# EAGLE design card (EAGLE 7.3.0)
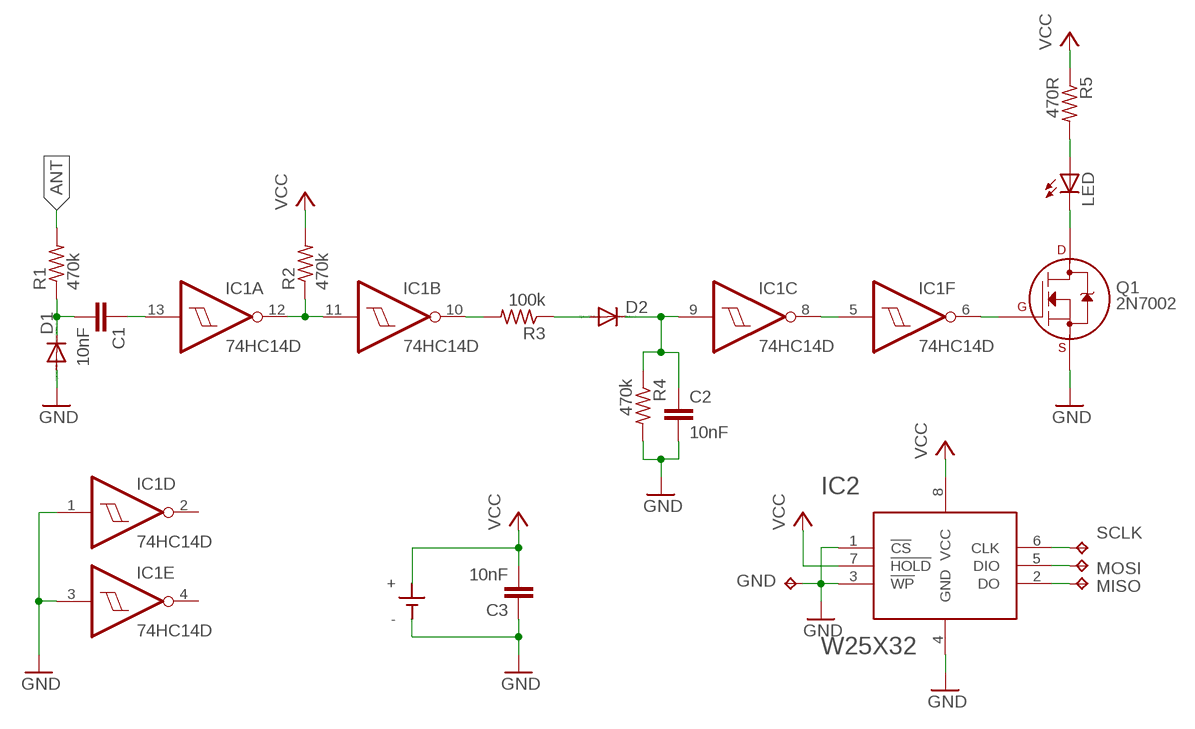
[diagram p0: schematic, sheet 1]

## Parts
BAT  KB3003  [KB3003]
C1  10nF  C-EUC1206K  [C1206K]
C2  10nF  C-EUC1206K  [C1206K]
C3  10nF  C-EUC1206K  [C1206K]
D1  DIODE-MINIMELF  [MINIMELF]
D2  DIODE-MINIMELF  [MINIMELF]
GND  TPB1,27  [B1,27]
IC1  74HC14D  [SO14]
IC2  W25X32  [SOIC8]
LED  LEDCHIPLED_1206  [CHIPLED_1206]
MISO  TPB1,27  [B1,27]
MOSI  TPB1,27  [B1,27]
Q1  2N7002  2N7000_SOT23  [SOT-23]
R1  470k  R-US_M1206  [M1206]
R2  470k  R-US_M1206  [M1206]
R3  100k  R-US_M1206  [M1206]
R4  470k  R-US_M1206  [M1206]
R5  470R  R-US_M1206  [M1206]
SCLK  TPB1,27  [B1,27]

## Nets
ANT: R1.2
GND: BAT.- C2.2 C3.1 D1.A GND.TP IC1.1(D:I) IC1.3(E:I) IC2.1(!CS!) IC2.3(!WP!) IC2.4(GND) Q1.2(S) R4.2
N$1: C1.1 IC1.13(A:I)
N$2: C1.2 D1.C R1.1
N$3: LED.A R5.2
N$4: LED.C Q1.3(D)
N$5: IC1.11(B:I) IC1.12(A:O) R2.1
N$6: IC1.10(B:O) R3.2
N$7: D2.A R3.1
N$8: C2.1 D2.C IC1.9(C:I) R4.1
N$9: IC2.5(DIO) MOSI.TP
N$10: IC2.6(CLK) SCLK.TP
N$11: IC1.5(F:I) IC1.8(C:O)
N$12: IC1.6(F:O) Q1.1(G)
N$88: IC2.2(DO) MISO.TP
VCC: BAT.+@1(+) BAT.+@2(+) C3.2 IC2.7(!HOLD!) IC2.8(VCC) R2.2 R5.1
Unconnected: IC1.2(D:O) IC1.4(E:O)

## Power pins joined to a net without a drawn wire
GND: IC1.7(P:GND)
VCC: IC1.14(P:VCC)

## Library data of the parts
BAT = bat:KB3003
C1-C3 = resistor:C-EU: CAPACITOR, European symbol
D1 D2 = diode:DIODE-: DIODE
GND MISO MOSI SCLK = testpad:TP: Test pad
IC1 = 74xx-eu:74*14: Hex schmitt trigger INVERTER
IC2 = bat:W25X32: Winbond W25X32 SPI Flash
LED = led:LED: LED OSRAM: - CHIPLED LG R971, LG N971, LY N971, LG Q971, LY Q971, LO R971, LY R971 LH N974, LH R974 LS Q976, LO Q976, LY Q976 LO Q996 - Hyper CHIPLED LW Q18S LB Q993, LB Q99A, LB R99A - SideLED LS A670, LO A670, LY A670, LG A670, LP A670 LB A673, LV A673, LT A673, LW A673 LH A674 LY A675 LS A676, LA A676, LO A676, LY A676, LW A676 LS A679, LY A679, LG A679 - Hyper Micro SIDELED® LS Y876, LA Y876, LO Y876, LY Y876 LT Y87S - SmartLED LW L88C, LW L88S LB L89C, LB L89S, LG L890 LS L89K, LO L89K, LY L89K LS L896, LA L896, LO L896, LY L896 - TOPLED LS T670, LO T670, LY T670, LG T670, LP T670 LSG T670, LSP T670, LSY T670, LOP T670, LYG T670 LG T671, LOG T671, LSG T671 LB T673, LV T673, LT T673, LW T673 LH T674 LS T676, LA T676, LO T676, LY T676, LB T676, LH T676, LSB T676, LW T676 LB T67C, LV T67C, LT T67C, LS T67K, LO T67K, LY T67K, LW E67C LS E67B, LA E67B, LO E67B, LY E67B, LB E67C, LV E67C, LT E67C LW T67C LS T679, LY T679, LG T679 LS T770, LO T770, LY T770, LG T770, LP T770 LB T773, LV T773, LT T773, LW T773 LH T774 LS E675, LA E675, LY E675, LS T675 LS T776, LA T776, LO T776, LY T776, LB T776 LHGB T686 LT T68C, LB T68C - Hyper Mini TOPLED® LB M676 - Mini TOPLED Santana® LG M470 LS M47K, LO M47K, LY M47K Source: http://www.osram.convergy.de LUXEON: - LUMILED® LXK2-PW12-R00, LXK2-PW12-S00, LXK2-PW14-U00, LXK2-PW14-V00 LXK2-PM12-R00, LXK2-PM12-S00, LXK2-PM14-U00 LXK2-PE12-Q00, LXK2-PE12-R00, LXK2-PE12-S00, LXK2-PE14-T00, LXK2-PE14-U00 LXK2-PB12-K00, LXK2-PB12-L00, LXK2-PB12-M00, LXK2-PB14-N00, LXK2-PB14-P00, LXK2-PB14-Q00 LXK2-PR12-L00, LXK2-PR12-M00, LXK2-PR14-Q00, LXK2-PR14-R00 LXK2-PD12-Q00, LXK2-PD12-R00, LXK2-PD12-S00 LXK2-PH12-R00, LXK2-PH12-S00 LXK2-PL12-P00, LXK2-PL12-Q00, LXK2-PL12-R00 Source: www.luxeon.com KINGBRIGHT: KA-3528ASYC Source: www.kingbright.com
Q1 = transistors:2N700*: 2N7000, 2N7002, NDS7002A N-channel enhancement mode MOSFET
R1-R5 = resistor:R-US_: RESISTOR, American symbol

## Board
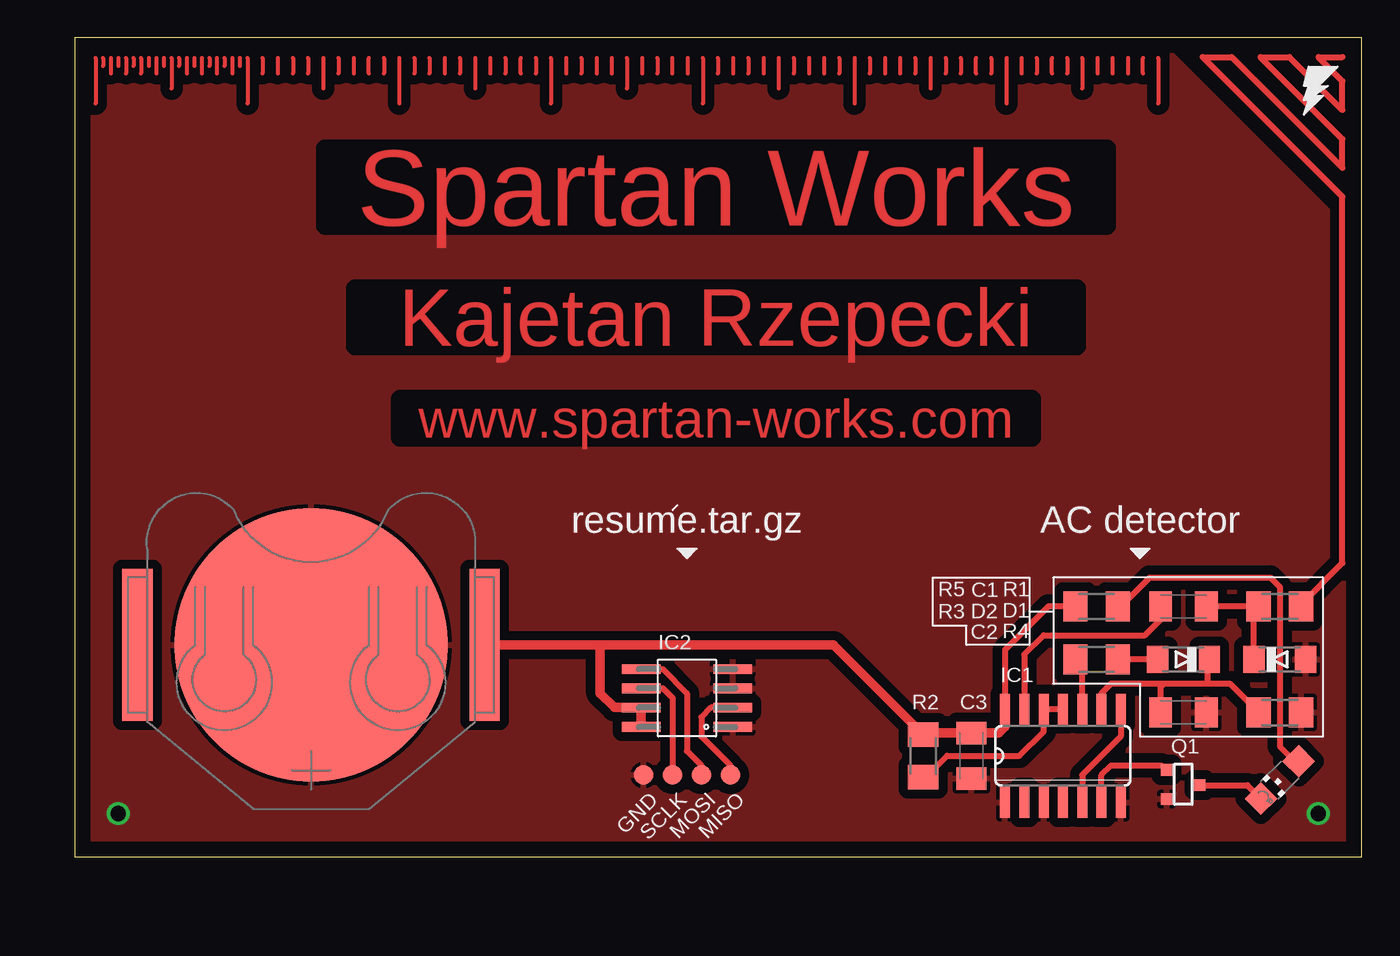
[diagram p1: board, top side]
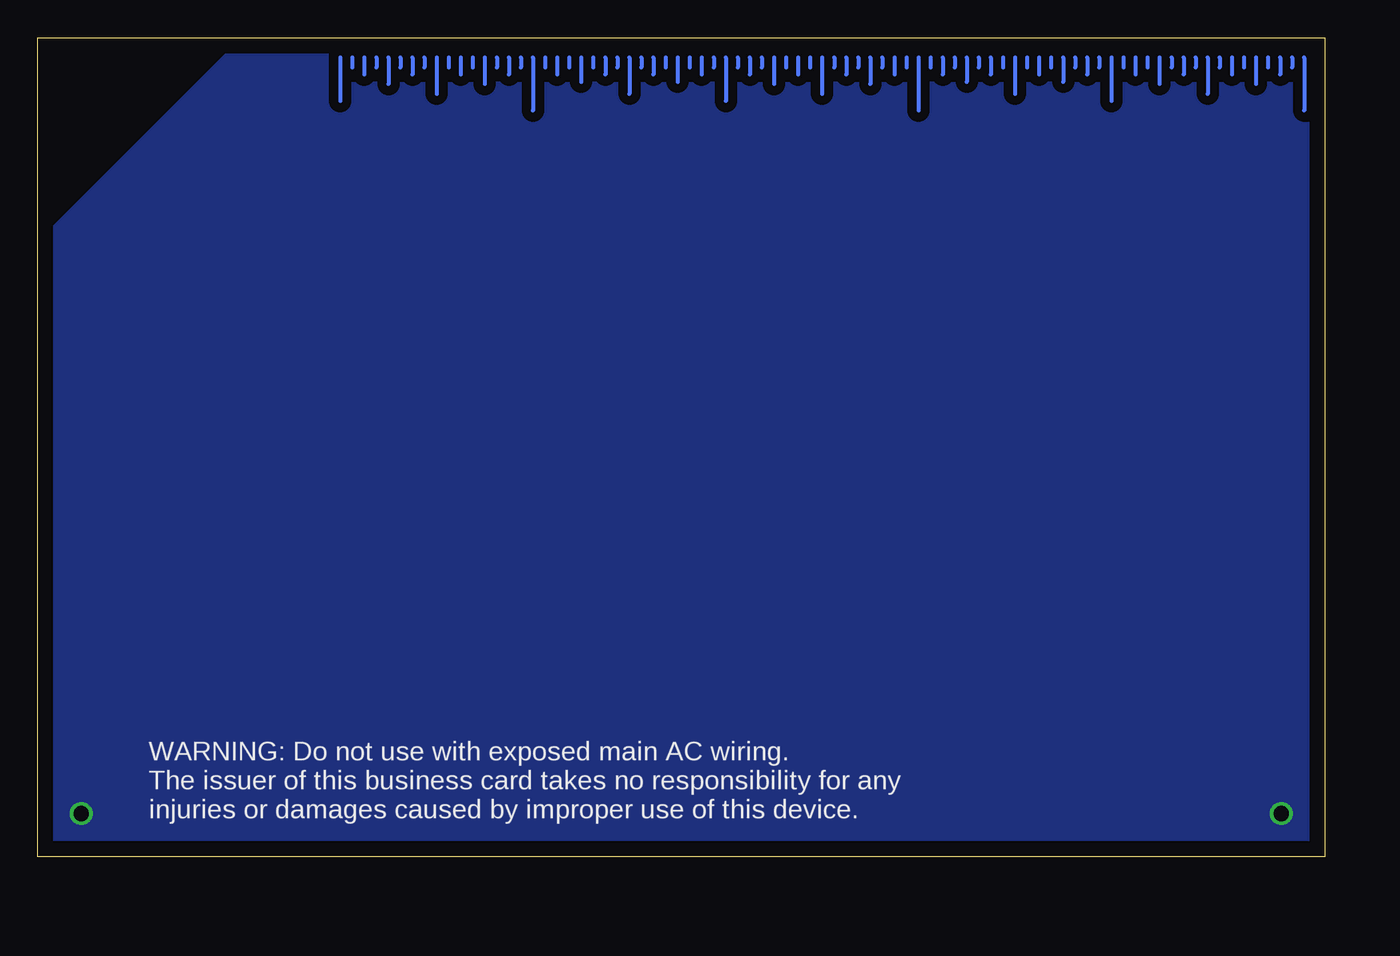
[diagram p2: board, bottom side, seen from below]

Size 84.76 x 53.97 mm. Coordinates in mm from the lower left corner, seen from the top.
Outline: 0,0 84.76,0 84.76,53.97 0,53.97 0,0
Copper layers (1*16): Top 0.035mm / dielectric 1.5mm / Bottom 0.035mm
Design rules "default": minimum track width 10mil, minimum drill 24mil, track to track 8mil, track to pad 8mil, pad to pad 8mil, via to via 8mil, smd to smd 8mil, copper to edge 40mil, drill to drill 8mil, minimum pad ring 10mil, minimum via ring 8mil, stop-mask expansion 4mil, vias tented up to drill 0mil, thermal gap 10mil

### Footprints (pad centres in the part's own frame; a part is rotated, then mirrored left to right if it is on the bottom)
KB3003 = smd 2 x 10: +@1 -11.43,0; +@2 11.43,0 | smd 18 x 18: - 0,0
C1206K = smd 1.5 x 2: 1 -1.5,0; 2 1.5,0
MINIMELF = smd 1.4 x 1.8: A 1.7,0; C -1.7,0
B1,27 = smd 1.27 x 1.27: TP 0,0
SO14 = smd 0.66 x 2.032: 1 -3.81,-3.073; 2 -2.54,-3.073; 3 -1.27,-3.073; 4 0,-3.073; 5 1.27,-3.073; 6 2.54,-3.073; 7 3.81,-3.073; 8 3.81,3.073; 9 2.54,3.073; 10 1.27,3.073; 11 0,3.073; 12 -1.27,3.073; 13 -2.54,3.073; 14 -3.81,3.073
SOIC8 = smd 2.54 x 0.635: 1 -3.016,2.54; 2 -3.016,1.27; 3 -3.016,0; 4 -3.016,-1.27; 5 3.016,-1.27; 6 3.016,0; 7 3.016,1.27; 8 3.016,2.54
CHIPLED_1206 = smd 1.5 x 1.5: A 0,-1.75; C 0,1.75
SOT-23 = smd 0.762 x 0.762: 1 -0.979,-1.101; 2 0.94,-1.101; 3 0.025,1.067
M1206 = smd 1.6 x 2: 1 -1.4,0; 2 1.4,0

### Placement (x,y rotation side)
BAT  15.56,13.97 0 top
C1  73.03,16.51 0 top
C2  73.03,9.53 0 top
C3  59.05,6.67 90 top
D1  79.38,13.02 0 top
D2  73.03,13.02 180 top
GND  37.47,5.4 180 top
IC1  65.09,6.67 0 top
IC2  40.32,11.11 180 top
LED  79.38,5.08 135 top
MISO  43.18,5.4 180 top
MOSI  41.27,5.4 180 top
Q1  73.03,4.76 270 top
R1  79.38,16.51 0 top
R2  55.88,6.67 90 top
R3  67.31,13.02 180 top
R4  79.38,9.53 0 top
R5  67.31,16.51 0 top
SCLK  39.37,5.4 180 top

### Tracks (layer width: path | path; a pad name or v marks a point on that pad's centre or on a via)
ANT
  Top 0.406: 83.5,52.7 81.92,52.7 83.5,51.12 83.5,49.21 80.01,52.7 78.11,52.7 83.5,47.31 83.5,45.4 76.2,52.7 74.3,52.7 83.5,43.5 83.5,19.37 80.78,16.64 R1.2
GND  (via drill 1)
  other vias: 81.92,2.86 2.86,2.86
  pour Top (isolate 0.61): 0,53.98 0,0 84.77,0 84.77,40.32 71.12,53.98
  pour Bottom (isolate 0.61): 0,53.98 71.12,53.98 84.77,40.32 84.77,0 0,0
N$1
  Top 0.406: IC1.13 62.55,13.34 63.82,14.61 70.48,14.61 71.53,15.64 C1.1
N$2
  Top 0.406: D1.C 77.67,15.89 R1.1 C1.2
N$3
  Top 0.406: R5.2 68.71,16.32 70.8,18.41 78.74,18.41 79.38,17.78 79.38,7.3 80.61,6.07 LED.A
N$4
  Top 0.406: Q1.3 77.24,4.74 LED.C
N$5
  Top 0.406: IC1.11 IC1.12 63.82,8.26 62.23,6.67 57.47,6.67 56.07,5.27 R2.1
N$6
  Top 0.406: IC1.10 66.36,12.57 R3.2
N$7
  Top 0.406: D2.A R3.1
N$8
  Top 0.406: IC1.9 67.63,10.79 68.26,11.43 71.75,11.43 | D2.C 74.61,12.81 74.61,11.43 | 74.3,12.59 D2.C | 74.61,12.9 D2.C | 71.75,11.43 74.61,11.43 | 74.61,11.43 76.07,11.43 R4.1 | C2.1 71.53,11.2 71.75,11.43
N$9
  Top 0.406: IC2.5 38.73,12.38 40.32,10.79 40.32,6.99 41.27,6.03 MOSI.TP
N$10
  Top 0.406: IC2.6 38.73,11.11 39.37,10.48 SCLK.TP
N$11
  Top 0.406: IC1.8 68.9,7.94 66.36,5.4 IC1.5
N$12
  Top 0.406: IC1.6 67.63,5.4 68.26,6.03 71.58,6.03 Q1.1
N$13
  Top 0.254: 1.86,52.63 1.86,52.13
N$14
  Top 0.254: 2.87,52.63 2.87,52.13
N$15
  Top 0.254: 3.87,52.63 3.87,52.13
N$16
  Top 0.254: 4.87,52.63 4.87,52.13
N$17
  Top 0.254: 1.36,52.63 1.36,49.63
N$18
  Top 0.254: 2.37,52.63 2.37,51.63
N$19
  Top 0.254: 3.37,52.63 3.37,51.63
N$20
  Top 0.254: 4.37,52.63 4.37,51.63
N$21
  Top 0.254: 5.37,52.63 5.37,51.63
N$22
  Top 0.254: 6.37,52.63 6.37,50.63
N$23
  Top 0.254: 7.37,52.63 7.37,51.63
N$24
  Top 0.254: 8.37,52.63 8.37,51.63
N$25
  Top 0.254: 9.37,51.63 9.37,52.63
N$26
  Top 0.254: 10.37,52.63 10.37,51.63
N$27
  Top 0.254: 11.37,52.63 11.37,49.63
N$28
  Top 0.254: 12.37,52.63 12.37,51.63
N$29
  Top 0.254: 13.37,52.63 13.37,51.63
N$30
  Top 0.254: 14.37,52.63 14.37,51.63
N$31
  Top 0.254: 15.37,52.63 15.37,51.63
N$32
  Top 0.254: 16.36,52.63 16.36,50.63
N$33
  Top 0.254: 17.36,52.63 17.36,51.63
N$34
  Top 0.254: 18.36,52.63 18.36,51.63
N$35
  Top 0.254: 19.36,51.63 19.36,52.63
N$36
  Top 0.254: 20.36,52.63 20.36,51.63
N$37
  Top 0.254: 21.36,52.63 21.36,49.63
N$38
  Top 0.254: 22.36,52.63 22.36,51.63
N$39
  Top 0.254: 23.36,52.63 23.36,51.63
N$40
  Top 0.254: 24.36,52.63 24.36,51.63
N$41
  Top 0.254: 25.36,52.63 25.36,51.63
N$42
  Top 0.254: 26.36,52.63 26.36,50.63
N$43
  Top 0.254: 27.36,52.63 27.36,51.63
N$44
  Top 0.254: 28.36,52.63 28.36,51.63
N$45
  Top 0.254: 29.36,51.63 29.36,52.63
N$46
  Top 0.254: 30.36,52.63 30.36,51.63
N$47
  Top 0.254: 31.36,52.63 31.36,49.63
N$48
  Top 0.254: 32.37,52.63 32.37,51.63
N$49
  Top 0.254: 33.37,52.63 33.37,51.63
N$50
  Top 0.254: 34.37,52.63 34.37,51.63
N$51
  Top 0.254: 35.37,52.63 35.37,51.63
N$52
  Top 0.254: 36.37,52.63 36.37,50.63
N$53
  Top 0.254: 37.37,52.63 37.37,51.63
N$54
  Top 0.254: 38.37,52.63 38.37,51.63
N$55
  Top 0.254: 39.37,51.63 39.37,52.63
N$56
  Top 0.254: 40.37,52.63 40.37,51.63
N$57
  Top 0.254: 41.37,52.63 41.37,49.63
N$58
  Top 0.254: 42.37,52.63 42.37,51.63
N$59
  Top 0.254: 43.37,52.63 43.37,51.63
N$60
  Top 0.254: 44.37,52.63 44.37,51.63
N$61
  Top 0.254: 45.37,52.63 45.37,51.63
N$62
  Top 0.254: 46.37,52.63 46.37,50.63
N$63
  Top 0.254: 47.37,52.63 47.37,51.63
N$64
  Top 0.254: 48.37,52.63 48.37,51.63
N$65
  Top 0.254: 49.37,51.63 49.37,52.63
N$66
  Top 0.254: 50.37,52.63 50.37,51.63
N$67
  Top 0.254: 51.37,52.63 51.37,49.63
N$68
  Top 0.254: 52.37,52.63 52.37,51.63
N$69
  Top 0.254: 53.37,52.63 53.37,51.63
N$70
  Top 0.254: 54.37,52.63 54.37,51.63
N$71
  Top 0.254: 55.37,52.63 55.37,51.63
N$72
  Top 0.254: 56.37,52.63 56.37,50.63
N$73
  Top 0.254: 57.37,52.63 57.37,51.63
N$74
  Top 0.254: 58.37,52.63 58.37,51.63
N$75
  Top 0.254: 59.37,51.63 59.37,52.63
N$76
  Top 0.254: 60.37,52.63 60.37,51.63
N$77
  Top 0.254: 61.37,52.63 61.37,49.63
N$78
  Top 0.254: 62.37,52.63 62.37,51.63
N$79
  Top 0.254: 63.37,52.63 63.37,51.63
N$80
  Top 0.254: 64.36,51.63 64.36,52.63
N$81
  Top 0.254: 65.36,52.63 65.36,51.63
N$82
  Top 0.254: 66.36,52.63 66.36,50.63
N$83
  Top 0.254: 67.36,52.63 67.36,51.63
N$84
  Top 0.254: 68.36,51.63 68.36,52.63
N$85
  Top 0.254: 5.87,52.63 5.87,52.13
N$86
  Top 0.254: 6.87,52.63 6.87,52.13
N$87
  Top 0.254: 71.36,52.63 71.36,49.63
N$88
  Top 0.406: IC2.2 41.91,9.84 41.27,9.21 41.27,7.94 43.18,6.03 MISO.TP
N$89
  Top 0.254: 69.36,52.63 69.36,51.63
N$90
  Top 0.254: 70.36,51.63 70.36,52.63
N$91
  Top 0.254: 7.87,52.63 7.87,52.13
N$92
  Top 0.254: 8.87,52.63 8.87,52.13
N$93
  Top 0.254: 9.87,52.63 9.87,52.13
N$94
  Top 0.254: 10.87,52.63 10.87,52.13
N$95
  Bottom 0.254: 1.35,52.67 1.35,49.17
N$96
  Bottom 0.254: 10.87,52.67 10.87,50.92
N$97
  Bottom 0.254: 17.22,52.67 17.22,51.08
N$98
  Bottom 0.254: 23.57,52.67 23.57,51.08
N$99
  Bottom 0.254: 2.94,52.67 2.94,51.55
N$100
  Bottom 0.254: 7.7,52.67 7.7,50.28
N$101
  Bottom 0.254: 6.11,52.67 6.11,51.55
N$102
  Bottom 0.254: 9.29,52.67 9.29,51.55
N$103
  Bottom 0.254: 12.46,52.67 12.46,51.55
N$104
  Bottom 0.254: 15.63,52.67 15.63,51.55
N$105
  Bottom 0.254: 14.05,52.67 14.05,49.81
N$106
  Bottom 0.254: 18.81,52.67 18.81,51.55
N$107
  Bottom 0.254: 21.98,52.67 21.98,51.55
N$108
  Bottom 0.254: 25.16,52.67 25.16,51.55
N$109
  Bottom 0.254: 2.14,52.67 2.14,52.03
N$110
  Bottom 0.254: 20.4,52.67 20.4,50.28
N$111
  Bottom 0.254: 3.73,52.67 3.73,52.03
N$112
  Bottom 0.254: 5.32,52.67 5.32,52.03
N$113
  Bottom 0.254: 6.9,52.67 6.9,52.03
N$114
  Bottom 0.254: 8.49,52.67 8.49,52.03
N$115
  Bottom 0.254: 26.75,52.67 26.75,49.17
N$116
  Bottom 0.254: 4.52,52.67 4.52,50.92
N$117
  Bottom 0.254: 10.08,52.67 10.08,52.03
N$118
  Bottom 0.254: 11.67,52.67 11.67,52.03
N$119
  Bottom 0.254: 13.25,52.67 13.25,52.03
N$120
  Bottom 0.254: 14.84,52.67 14.84,52.03
N$121
  Bottom 0.254: 16.43,52.67 16.43,52.03
N$122
  Bottom 0.254: 18.02,52.67 18.02,52.03
N$123
  Bottom 0.254: 19.6,52.67 19.6,52.03
N$124
  Bottom 0.254: 21.19,52.67 21.19,52.03
N$125
  Bottom 0.254: 22.78,52.67 22.78,52.03
N$126
  Bottom 0.254: 24.37,52.67 24.37,52.03
N$127
  Bottom 0.254: 25.95,52.67 25.95,52.03
N$128
  Bottom 0.254: 33.1,52.67 33.1,50.28
N$129
  Bottom 0.254: 39.45,52.67 39.45,49.81
N$130
  Bottom 0.254: 45.8,52.67 45.8,50.28
N$131
  Bottom 0.254: 29.92,52.67 29.92,50.92
N$132
  Bottom 0.254: 36.27,52.67 36.27,50.92
N$133
  Bottom 0.254: 42.62,52.67 42.62,51.08
N$134
  Bottom 0.254: 48.97,52.67 48.97,51.08
N$135
  Bottom 0.254: 28.34,52.67 28.34,51.55
N$136
  Bottom 0.254: 31.51,52.67 31.51,51.55
N$137
  Bottom 0.254: 34.69,52.67 34.69,51.55
N$138
  Bottom 0.254: 37.86,52.67 37.86,51.55
N$139
  Bottom 0.254: 41.03,52.67 41.03,51.55
N$140
  Bottom 0.254: 44.21,52.67 44.21,51.55
N$141
  Bottom 0.254: 47.38,52.67 47.38,51.55
N$142
  Bottom 0.254: 50.56,52.67 50.56,51.55
N$143
  Bottom 0.254: 27.54,52.67 27.54,52.03
N$144
  Bottom 0.254: 29.13,52.67 29.13,52.03
N$145
  Bottom 0.254: 30.72,52.67 30.72,52.03
N$146
  Bottom 0.254: 32.3,52.67 32.3,52.03
N$147
  Bottom 0.254: 33.89,52.67 33.89,52.03
N$148
  Bottom 0.254: 35.48,52.67 35.48,52.03
N$149
  Bottom 0.254: 37.07,52.67 37.07,52.03
N$150
  Bottom 0.254: 38.65,52.67 38.65,52.03
N$151
  Bottom 0.254: 40.24,52.67 40.24,52.03
N$152
  Bottom 0.254: 41.83,52.67 41.83,52.03
N$153
  Bottom 0.254: 43.42,52.67 43.42,52.03
N$154
  Bottom 0.254: 45,52.67 45,52.03
N$155
  Bottom 0.254: 46.59,52.67 46.59,52.03
N$156
  Bottom 0.254: 48.18,52.67 48.18,52.03
N$157
  Bottom 0.254: 49.77,52.67 49.77,52.03
N$158
  Bottom 0.254: 51.35,52.67 51.35,52.03
N$159
  Bottom 0.254: 52.15,52.67 52.15,49.17
N$160
  Bottom 0.254: 58.5,52.67 58.5,50.28
N$161
  Bottom 0.254: 64.85,52.67 64.85,49.81
N$163
  Bottom 0.254: 55.32,52.67 55.32,50.92
N$164
  Bottom 0.254: 61.67,52.67 61.67,50.92
N$167
  Bottom 0.254: 53.73,52.67 53.73,51.55
N$168
  Bottom 0.254: 56.91,52.67 56.91,51.55
N$169
  Bottom 0.254: 60.09,52.67 60.09,51.55
N$170
  Bottom 0.254: 63.26,52.67 63.26,51.55
N$175
  Bottom 0.254: 52.94,52.67 52.94,52.03
N$176
  Bottom 0.254: 54.53,52.67 54.53,52.03
N$177
  Bottom 0.254: 56.12,52.67 56.12,52.03
N$178
  Bottom 0.254: 57.7,52.67 57.7,52.03
N$179
  Bottom 0.254: 59.29,52.67 59.29,52.03
N$180
  Bottom 0.254: 60.88,52.67 60.88,52.03
N$181
  Bottom 0.254: 62.47,52.67 62.47,52.03
N$182
  Bottom 0.254: 64.05,52.67 64.05,52.03
VCC
  Top 0.406: R5.1 64.14,16.51 61.28,13.65 IC1.14
  Top 0.61: IC1.14 61.28,8.57 60.87,8.17 C3.2 55.98,8.17 R2.2 49.98,13.97 34.61,13.97 | BAT.+@2 34.61,13.97 | IC2.8 IC2.7 35.56,9.84 34.61,10.79 34.61,13.97

### Text on the board
Top: Spartan Works | Kajetan Rzepecki | www.spartan-works.com
tNames: resume.tar.gz | AC detector
bNames: WARNING: Do not use with exposed main AC wiring. / The issuer of this business card takes no responsibility for any / injuries or damages caused by improper use of this device.
tCream: Spartan Works | Kajetan Rzepecki | www.spartan-works.com